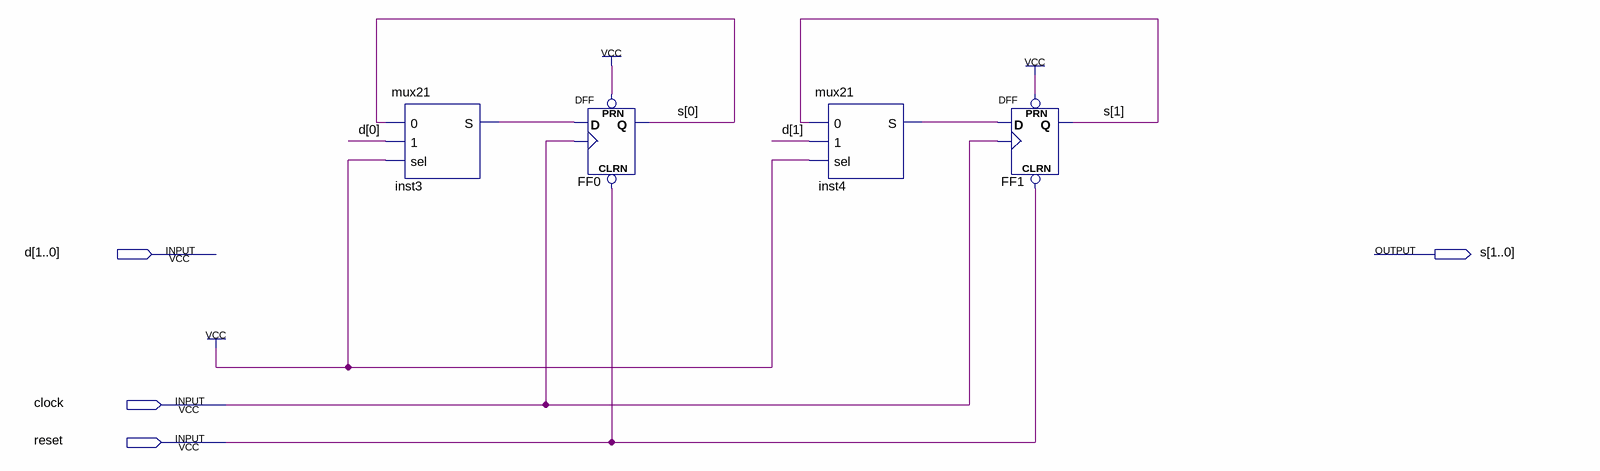
[diagram p0: schematic sheet]
// Quartus schematic reg2b.bdf as structural Verilog: 4 symbols, 4 pins
module reg2b (
  input  [1:0] d,
  input  clock,
  input  reset,
  output [1:0] s
);

  wire inst3_s, inst4_s;

  mux21 inst3 (.\0 (s[0]), .\1 (d[0]), .sel(1'b1), .S(inst3_s));
  DFF FF0 (.CLRN(reset), .CLK(clock), .D(inst3_s), .PRN(1'b1), .Q(s[0]));
  mux21 inst4 (.\0 (s[1]), .\1 (d[1]), .sel(1'b1), .S(inst4_s));
  DFF FF1 (.CLRN(reset), .CLK(clock), .D(inst4_s), .PRN(1'b1), .Q(s[1]));
endmodule
